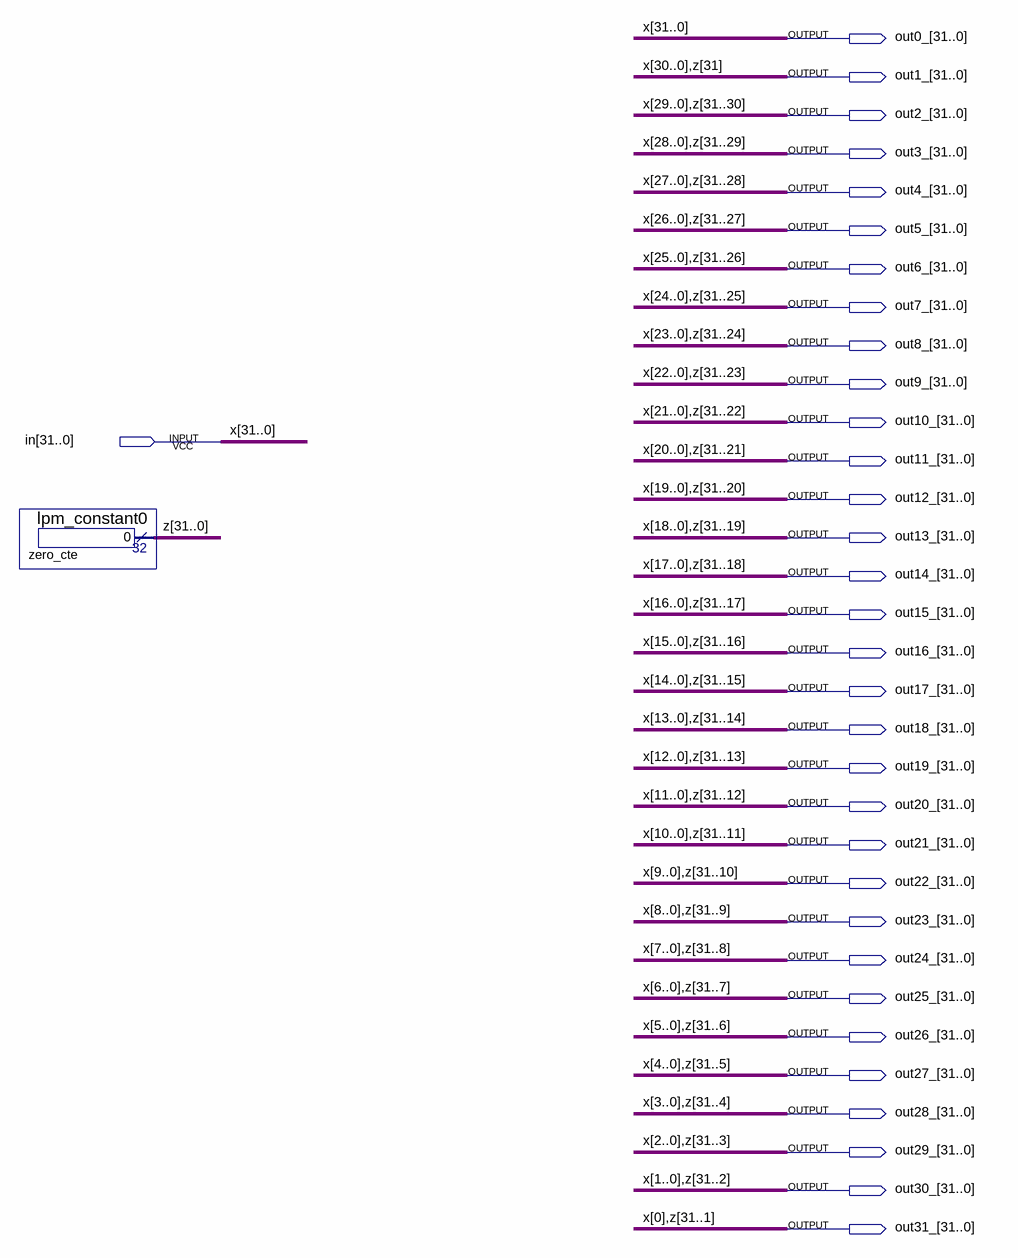
[diagram p0: schematic sheet]
// Quartus schematic l_extender32.bdf as structural Verilog: 1 symbols, 33 pins
module l_extender32 (
  input  [31:0] in,
  output [31:0] out0_,
  output [31:0] out1_,
  output [31:0] out2_,
  output [31:0] out3_,
  output [31:0] out4_,
  output [31:0] out5_,
  output [31:0] out6_,
  output [31:0] out7_,
  output [31:0] out8_,
  output [31:0] out9_,
  output [31:0] out10_,
  output [31:0] out11_,
  output [31:0] out12_,
  output [31:0] out13_,
  output [31:0] out14_,
  output [31:0] out15_,
  output [31:0] out16_,
  output [31:0] out17_,
  output [31:0] out18_,
  output [31:0] out19_,
  output [31:0] out20_,
  output [31:0] out21_,
  output [31:0] out22_,
  output [31:0] out23_,
  output [31:0] out24_,
  output [31:0] out25_,
  output [31:0] out26_,
  output [31:0] out27_,
  output [31:0] out28_,
  output [31:0] out29_,
  output [31:0] out30_,
  output [31:0] out31_
);

  wire [0:0] z;

  lpm_constant0 zero_cte (.result({out1_[0], out2_[0], out3_[0], out4_[0], out5_[0], out6_[0], out7_[0], out8_[0], out9_[0], out10_[0], out11_[0], out12_[0], out13_[0], out14_[0], out15_[0], out16_[0], out17_[0], out18_[0], out19_[0], out20_[0], out21_[0], out22_[0], out23_[0], out24_[0], out25_[0], out26_[0], out27_[0], out28_[0], out29_[0], out30_[0], out31_[0], z[0]}));

  assign out0_ = in;
  assign out1_[31:1] = in[30:0];
  assign out2_[31:1] = {in[29:0], out1_[0]};
  assign out3_[31:1] = {in[28:0], out1_[0], out2_[0]};
  assign out4_[31:1] = {in[27:0], out1_[0], out2_[0], out3_[0]};
  assign out5_[31:1] = {in[26:0], out1_[0], out2_[0], out3_[0], out4_[0]};
  assign out6_[31:1] = {in[25:0], out1_[0], out2_[0], out3_[0], out4_[0], out5_[0]};
  assign out7_[31:1] = {in[24:0], out1_[0], out2_[0], out3_[0], out4_[0], out5_[0], out6_[0]};
  assign out8_[31:1] = {in[23:0], out1_[0], out2_[0], out3_[0], out4_[0], out5_[0], out6_[0], out7_[0]};
  assign out9_[31:1] = {in[22:0], out1_[0], out2_[0], out3_[0], out4_[0], out5_[0], out6_[0], out7_[0], out8_[0]};
  assign out10_[31:1] = {in[21:0], out1_[0], out2_[0], out3_[0], out4_[0], out5_[0], out6_[0], out7_[0], out8_[0], out9_[0]};
  assign out11_[31:1] = {in[20:0], out1_[0], out2_[0], out3_[0], out4_[0], out5_[0], out6_[0], out7_[0], out8_[0], out9_[0], out10_[0]};
  assign out12_[31:1] = {in[19:0], out1_[0], out2_[0], out3_[0], out4_[0], out5_[0], out6_[0], out7_[0], out8_[0], out9_[0], out10_[0], out11_[0]};
  assign out13_[31:1] = {in[18:0], out1_[0], out2_[0], out3_[0], out4_[0], out5_[0], out6_[0], out7_[0], out8_[0], out9_[0], out10_[0], out11_[0], out12_[0]};
  assign out14_[31:1] = {in[17:0], out1_[0], out2_[0], out3_[0], out4_[0], out5_[0], out6_[0], out7_[0], out8_[0], out9_[0], out10_[0], out11_[0], out12_[0], out13_[0]};
  assign out15_[31:1] = {in[16:0], out1_[0], out2_[0], out3_[0], out4_[0], out5_[0], out6_[0], out7_[0], out8_[0], out9_[0], out10_[0], out11_[0], out12_[0], out13_[0], out14_[0]};
  assign out16_[31:1] = {in[15:0], out1_[0], out2_[0], out3_[0], out4_[0], out5_[0], out6_[0], out7_[0], out8_[0], out9_[0], out10_[0], out11_[0], out12_[0], out13_[0], out14_[0], out15_[0]};
  assign out17_[31:1] = {in[14:0], out1_[0], out2_[0], out3_[0], out4_[0], out5_[0], out6_[0], out7_[0], out8_[0], out9_[0], out10_[0], out11_[0], out12_[0], out13_[0], out14_[0], out15_[0], out16_[0]};
  assign out18_[31:1] = {in[13:0], out1_[0], out2_[0], out3_[0], out4_[0], out5_[0], out6_[0], out7_[0], out8_[0], out9_[0], out10_[0], out11_[0], out12_[0], out13_[0], out14_[0], out15_[0], out16_[0], out17_[0]};
  assign out19_[31:1] = {in[12:0], out1_[0], out2_[0], out3_[0], out4_[0], out5_[0], out6_[0], out7_[0], out8_[0], out9_[0], out10_[0], out11_[0], out12_[0], out13_[0], out14_[0], out15_[0], out16_[0], out17_[0], out18_[0]};
  assign out20_[31:1] = {in[11:0], out1_[0], out2_[0], out3_[0], out4_[0], out5_[0], out6_[0], out7_[0], out8_[0], out9_[0], out10_[0], out11_[0], out12_[0], out13_[0], out14_[0], out15_[0], out16_[0], out17_[0], out18_[0], out19_[0]};
  assign out21_[31:1] = {in[10:0], out1_[0], out2_[0], out3_[0], out4_[0], out5_[0], out6_[0], out7_[0], out8_[0], out9_[0], out10_[0], out11_[0], out12_[0], out13_[0], out14_[0], out15_[0], out16_[0], out17_[0], out18_[0], out19_[0], out20_[0]};
  assign out22_[31:1] = {in[9:0], out1_[0], out2_[0], out3_[0], out4_[0], out5_[0], out6_[0], out7_[0], out8_[0], out9_[0], out10_[0], out11_[0], out12_[0], out13_[0], out14_[0], out15_[0], out16_[0], out17_[0], out18_[0], out19_[0], out20_[0], out21_[0]};
  assign out23_[31:1] = {in[8:0], out1_[0], out2_[0], out3_[0], out4_[0], out5_[0], out6_[0], out7_[0], out8_[0], out9_[0], out10_[0], out11_[0], out12_[0], out13_[0], out14_[0], out15_[0], out16_[0], out17_[0], out18_[0], out19_[0], out20_[0], out21_[0], out22_[0]};
  assign out24_[31:1] = {in[7:0], out1_[0], out2_[0], out3_[0], out4_[0], out5_[0], out6_[0], out7_[0], out8_[0], out9_[0], out10_[0], out11_[0], out12_[0], out13_[0], out14_[0], out15_[0], out16_[0], out17_[0], out18_[0], out19_[0], out20_[0], out21_[0], out22_[0], out23_[0]};
  assign out25_[31:1] = {in[6:0], out1_[0], out2_[0], out3_[0], out4_[0], out5_[0], out6_[0], out7_[0], out8_[0], out9_[0], out10_[0], out11_[0], out12_[0], out13_[0], out14_[0], out15_[0], out16_[0], out17_[0], out18_[0], out19_[0], out20_[0], out21_[0], out22_[0], out23_[0], out24_[0]};
  assign out26_[31:1] = {in[5:0], out1_[0], out2_[0], out3_[0], out4_[0], out5_[0], out6_[0], out7_[0], out8_[0], out9_[0], out10_[0], out11_[0], out12_[0], out13_[0], out14_[0], out15_[0], out16_[0], out17_[0], out18_[0], out19_[0], out20_[0], out21_[0], out22_[0], out23_[0], out24_[0], out25_[0]};
  assign out27_[31:1] = {in[4:0], out1_[0], out2_[0], out3_[0], out4_[0], out5_[0], out6_[0], out7_[0], out8_[0], out9_[0], out10_[0], out11_[0], out12_[0], out13_[0], out14_[0], out15_[0], out16_[0], out17_[0], out18_[0], out19_[0], out20_[0], out21_[0], out22_[0], out23_[0], out24_[0], out25_[0], out26_[0]};
  assign out28_[31:1] = {in[3:0], out1_[0], out2_[0], out3_[0], out4_[0], out5_[0], out6_[0], out7_[0], out8_[0], out9_[0], out10_[0], out11_[0], out12_[0], out13_[0], out14_[0], out15_[0], out16_[0], out17_[0], out18_[0], out19_[0], out20_[0], out21_[0], out22_[0], out23_[0], out24_[0], out25_[0], out26_[0], out27_[0]};
  assign out29_[31:1] = {in[2:0], out1_[0], out2_[0], out3_[0], out4_[0], out5_[0], out6_[0], out7_[0], out8_[0], out9_[0], out10_[0], out11_[0], out12_[0], out13_[0], out14_[0], out15_[0], out16_[0], out17_[0], out18_[0], out19_[0], out20_[0], out21_[0], out22_[0], out23_[0], out24_[0], out25_[0], out26_[0], out27_[0], out28_[0]};
  assign out30_[31:1] = {in[1:0], out1_[0], out2_[0], out3_[0], out4_[0], out5_[0], out6_[0], out7_[0], out8_[0], out9_[0], out10_[0], out11_[0], out12_[0], out13_[0], out14_[0], out15_[0], out16_[0], out17_[0], out18_[0], out19_[0], out20_[0], out21_[0], out22_[0], out23_[0], out24_[0], out25_[0], out26_[0], out27_[0], out28_[0], out29_[0]};
  assign out31_[31:1] = {in[0], out1_[0], out2_[0], out3_[0], out4_[0], out5_[0], out6_[0], out7_[0], out8_[0], out9_[0], out10_[0], out11_[0], out12_[0], out13_[0], out14_[0], out15_[0], out16_[0], out17_[0], out18_[0], out19_[0], out20_[0], out21_[0], out22_[0], out23_[0], out24_[0], out25_[0], out26_[0], out27_[0], out28_[0], out29_[0], out30_[0]};

  // Other names for the same wires on the sheet: x[31:0] = in;
  //   z[31:1] = {out1_[0], out2_[0], out3_[0], out4_[0], out5_[0], out6_[0], out7_[0], out8_[0], out9_[0], out10_[0], out11_[0], out12_[0], out13_[0], out14_[0], out15_[0], out16_[0], out17_[0], out18_[0], out19_[0], out20_[0], out21_[0], out22_[0], out23_[0], out24_[0], out25_[0], out26_[0], out27_[0], out28_[0], out29_[0], out30_[0], out31_[0]}
endmodule
